# Altium schematic sheet tinybord.SchDoc
size A4
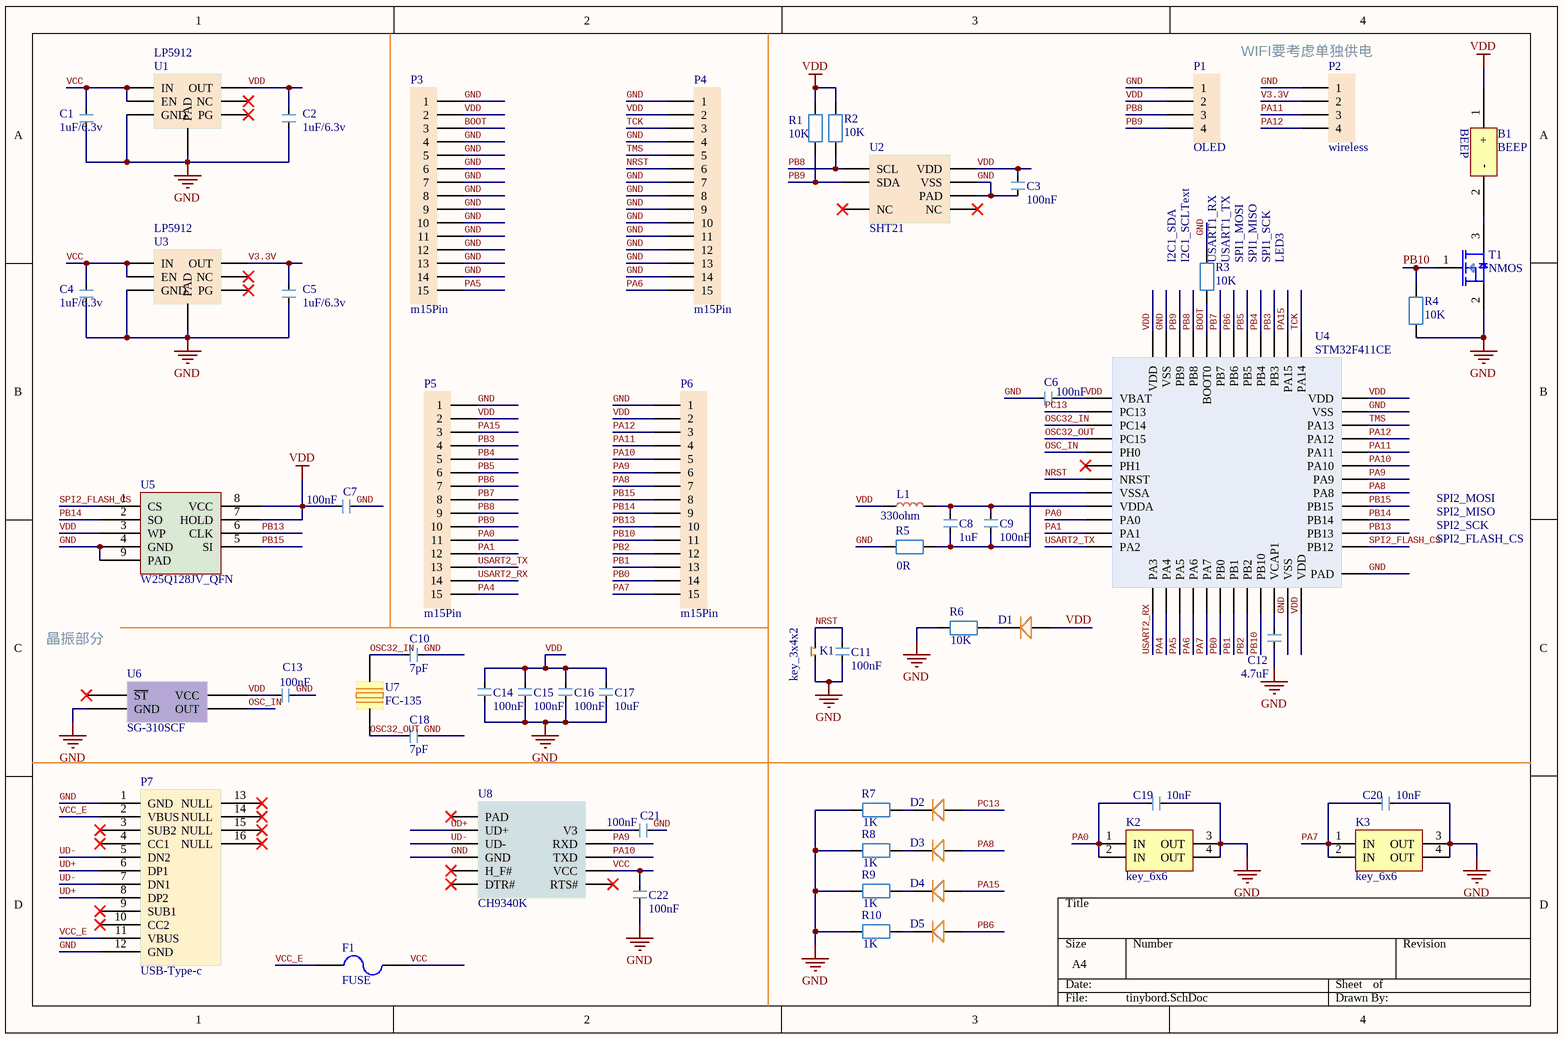
[diagram p0: tinybord.SchDoc]

## Parts
B1  BEEP  [BEEP0905]
C1  value 1uF/6.3v  [C0603]  (hidden comment: C0603)
C2  value 1uF/6.3v  [C0603]  (hidden comment: C0603)
C3  value 100nF  [C0603]  (hidden comment: C0603)
C4  value 1uF/6.3v  [C0603]  (hidden comment: C0603)
C5  value 1uF/6.3v  [C0603]  (hidden comment: C0603)
C6  value 100nF  [C0603]  (hidden comment: C0603)
C7  value 100nF  [C0603]  (hidden comment: C0603)
C8  value 1uF  [C0603]  (hidden comment: C0603)
C9  value 100nF  [C0603]  (hidden comment: C0603)
C10  value 7pF  [C0603]  (hidden comment: C0603)
C11  value 100nF  [C0603]  (hidden comment: C0603)
C12  value 4.7uF  [C0603]  (hidden comment: C0603)
C13  value 100nF  [C0603]  (hidden comment: C0603)
C14  value 100nF  [C0603]  (hidden comment: C0603)
C15  value 100nF  [C0603]  (hidden comment: C0603)
C16  value 100nF  [C0603]  (hidden comment: C0603)
C17  value 10uF  [C0603]  (hidden comment: C0603)
C18  value 7pF  [C0603]  (hidden comment: C0603)
C19  value 10nF  [C0603]  (hidden comment: C0603)
C20  value 10nF  [C0603]  (hidden comment: C0603)
C21  value 100nF  [C0603]  (hidden comment: C0603)
C22  value 100nF  [C0603]  (hidden comment: C0603)
D1  L0603  [led0603]  (value not drawn)
D2  L0603  [led0603]  (value not drawn)
D3  L0603  [led0603]  (value not drawn)
D4  L0603  [led0603]  (value not drawn)
D5  L0603  [led0603]  (value not drawn)
F1  FUSE  [R0603]
K1  key_3x4x2  [Key 3x4x2]
K2  key_6x6  [Key 6x6]
K3  key_6x6  [Key 6x6]
L1  value 330ohm  [B0603]  (hidden comment: B0603)
P1  OLED  [4x1 header]
P2  wireless  [4x1 header]
P3  m15Pin  [15x1 header]
P4  m15Pin  [15x1 header]
P5  m15Pin  [15x1 header]
P6  m15Pin  [15x1 header]
P7  USB-Type-c  [USB-TYPE-C]
R1  value 10K  [R0603]  (hidden comment: R0603)
R2  value 10K  [R0603]  (hidden comment: R0603)
R3  value 10K  [R0603]  (hidden comment: R0603)
R4  value 10K  [R0603]  (hidden comment: R0603)
R5  value 0R  [R0603]  (hidden comment: R0603)
R6  value 10K  [R0603]  (hidden comment: R0603)
R7  value 1K  [R0603]  (hidden comment: R0603)
R8  value 1K  [R0603]  (hidden comment: R0603)
R9  value 1K  [R0603]  (hidden comment: R0603)
R10  value 1K  [R0603]  (hidden comment: R0603)
T1  NMOS  [NMOS-BSH103]
U1  LP5912  [LP5912]
U2  SHT21  [SHT21]
U3  LP5912  [LP5912]
U4  STM32F411CE  [STM32F411CE QFN]
U5  W25Q128JV_QFN  [W25Q64 QFN]
U6  SG-310SCF  [SG-310SCF]
U7  FC-135  [FC-135]
U8  CH9340K  [CH9340]

## Nets
GND: C1.1 C2.1 C3.1 C4.1 C5.1 C6.1 C7.2 C10.1 C11.1 C12.1 C13.2 C14.1 C15.1 C16.1 C17.1 C18.1 C19.1 C20.1 C21.2 C22.1 K1.1 K2.3(OUT) K2.4(OUT) K3.3(OUT) K3.4(OUT) P1.1 P2.1 P3.1 P3.4 P3.5 P3.6 P3.7 P3.8 P3.9 P3.10 P3.11 P3.12 P3.13 P3.14 P4.1 P4.4 P4.7 P4.8 P4.9 P4.10 P4.11 P4.12 P4.13 P4.14 P5.1 P6.1 P7.1(GND) P7.12(GND) R3.2 R4.1 R5.1 R6.1 R7.1 R8.1 R9.1 R10.1 T1.2(S) U1.5(GND) U1.7(PAD) U2.2(VSS) U2.7(PAD) U3.5(GND) U3.7(PAD) U4.23(VSS) U4.35(VSS) U4.47(VSS) U4.49(PAD) U5.4(GND) U5.9(PAD) U6.2(GND) U8.3(GND)
VDD: B1.1(+) C2.2 C3.2 C6.2 C7.1 C13.1 C14.2 C15.2 C16.2 C17.2 D1.2 L1.1 P1.2 P3.2 P4.2 P5.2 P6.2 R1.2 R2.2 U1.1(OUT) U2.5(VDD) U4.1(VBAT) U4.24(VDD) U4.36(VDD) U4.48(VDD) U5.3(WP) U5.7(HOLD) U5.8(VCC) U6.4(VCC)
BOOT: P3.3 R3.1 U4.44(BOOT0)
NRST: C11.2 K1.2 P4.6 U4.7(NRST)
OSC32_IN: C10.2 U4.3(PC14) U7.2
OSC32_OUT: C18.2 U4.4(PC15) U7.1
OSC_IN: U4.5(PH0) U6.3(OUT)
PA0: C19.2 K2.1(IN) K2.2(IN) P5.11 U4.10(PA0)
PA1: P5.12 U4.11(PA1)
PA4: P5.15 U4.14(PA4)
PA5: P3.15 U4.15(PA5)
PA6: P4.15 U4.16(PA6)
PA7: C20.2 K3.1(IN) K3.2(IN) P6.15 U4.17(PA7)
PA8: D3.2 P6.7 U4.29(PA8)
PA9: P6.6 U4.30(PA9) U8.9(RXD)
PA10: P6.5 U4.31(PA10) U8.8(TXD)
PA11: P2.3 P6.4 U4.32(PA11)
PA12: P2.4 P6.3 U4.33(PA12)
PA15: D4.2 P5.3 U4.38(PA15)
PB0: P6.14 U4.18(PB0)
PB1: P6.13 U4.19(PB1)
PB2: P6.12 U4.20(PB2)
PB3: P5.4 U4.39(PB3)
PB4: P5.5 U4.40(PB4)
PB5: P5.6 U4.41(PB5)
PB6: D5.2 P5.7 U4.42(PB6)
PB7: P5.8 U4.43(PB7)
PB8: P1.3 P5.9 R2.1 U2.6(SCL) U4.45(PB8)
PB9: P1.4 P5.10 R1.1 U2.1(SDA) U4.46(PB9)
PB10: P6.11 R4.2 T1.1(G) U4.21(PB10)
PB13: P6.10 U4.26(PB13) U5.6(CLK)
PB14: P6.9 U4.27(PB14) U5.2(SO)
PB15: P6.8 U4.28(PB15) U5.5(SI)
PC13: D2.2 U4.2(PC13)
SPI2_FLASH_CS: U4.25(PB12) U5.1(CS)
TCK: P4.3 U4.37(PA14)
TMS: P4.5 U4.34(PA13)
UD+: P7.6(DP1) P7.8(DP2) U8.1(UD+)
UD-: P7.5(DN2) P7.7(DN1) U8.2(UD-)
USART2_RX: P5.14 U4.13(PA3)
USART2_TX: P5.13 U4.12(PA2)
V3.3V: C5.2 P2.2 U3.1(OUT)
VCC: C1.2 C4.2 C22.2 F1.2 U1.4(EN) U1.6(IN) U3.4(EN) U3.6(IN) U8.7(VCC)
VCC_E: F1.1 P7.2(VBUS) P7.11(VBUS)
NetB1_2: B1.2(-) T1.3(D)
NetC8_1: C8.1 C9.1 R5.2 U4.8(VSSA)
NetC8_2: C8.2 C9.2 L1.2 U4.9(VDDA)
NetC12_2: C12.2 U4.22(VCAP1)
NetC21_1: C21.1 U8.10(V3)
NetD1_1: D1.1 R6.2
NetD2_1: D2.1 R7.2
NetD3_1: D3.1 R8.2
NetD4_1: D4.1 R9.2
NetD5_1: D5.1 R10.2

Not connected (* = marked no-connect by the designer): P7 3(SUB2)* 4(CC1)* 9(SUB1)* 10(CC2)* 13(NULL)* 14(NULL)* 15(NULL)* 16(NULL)*; U1 2(NC)* 3(PG)*; U2 3(NC)* 4(NC)*; U3 2(NC)* 3(PG)*; U4 6(PH1)*; U6 1(~{ST})*; U8 4(H_F#)* 5(DTR#)* 6(RTS#)* 11(PAD)*

## Notes on the sheet
- (near P2) WIFI要考虑单独供电
- (near R3) I2C1_SDA
- (near R3) I2C1_SCLText
- (near R3) USART1_RX
- (near R3) USART1_TX
- (near R3) SPI1_MOSI
- (near R3) SPI1_MISO
- SPI1_SCK
- LED3
- SPI2_MOSI
- SPI2_MISO
- SPI2_SCK
- SPI2_FLASH_CS
- 晶振部分

## Library data of the parts
B1 = BEEP: 12*6
C1-C22 = C0603: 陶瓷电容
D1-D5 = L0603: LED
F1 = PTC0603: PTC 1812
K1 = key_3x4x2: 贴片按键
K2 K3 = key_6x6: 贴片按键
L1 = B0603: 磁珠
P1 P2 = m4Pin: 1x4pin 1.27mm
P3-P6 = m15Pin: 1x4pin 1.27mm
P7 = USB-Type-c: use typec 16p
R1-R10 = R0603: 电阻
T1 = NMOS-BSH103: infineon P-Chanel
U1 U3 = LP5912: LDO
U2 = SHT21: 温湿度传感器
U4 = STM32F411CE: STM32F411 QFN48PIN
U5 = W25Q128JV_QFN: flash
U6 = SG-310SCF: 有源晶振3225
U7 = FC-135: 32.768K无源晶振
U8 = CH9340K: USB转串口